# Altium schematic sheet [11]-BATTERY_BACKUP.SchDoc
size A4
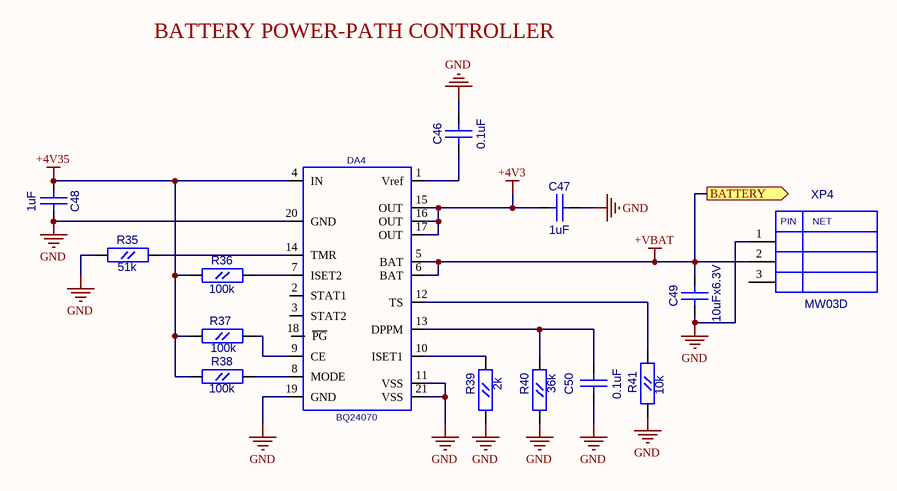
[diagram p0: [11]-BATTERY_BACKUP.SchDoc]

## Parts
C46  0.1uF  [CC0603]
C47  1uF  [CC0603]
C48  1uF  [CC0603]
C49  10uFx6.3V  [CC0805]
C50  0.1uF  [CC0603]
DA4  BQ24070  [P-PQFP-N20]
R35  51k  [RC0603]
R36  100k  [RC0603]
R37  100k  [RC0603]
R38  100k  [RC0603]
R39  2k  [RC0603]
R40  36k  [RC0603]
R41  10k  [RC0603]
XP4  MW03D  [MW03D]

## Ports
BATTERY (out)

## Nets
+4V3: C47.1(A) DA4.15(OUT) DA4.16(OUT) DA4.17(OUT)
+4V35: C48.1(A) DA4.4(IN) R36.2(B) R37.2(B) R38.2(B)
+VBAT: C49.2(B) DA4.5(BAT) DA4.6(BAT) XP4.2 ; port BATTERY
GND: C46.2(B) C47.2(B) C48.2(B) C49.1(A) C50.2(B) DA4.11(VSS) DA4.19(GND) DA4.20(GND) DA4.21(VSS) R35.2(B) R39.2(B) R40.2(B) R41.2(B) XP4.1
NetC46_1: C46.1(A) DA4.1(Vref)
NetC50_1: C50.1(A) DA4.13(DPPM) R40.1(A)
NetDA4_7: DA4.7(ISET2) R36.1(A)
NetDA4_8: DA4.8(MODE) R38.1(A)
NetDA4_9: DA4.9(CE) R37.1(A)
NetDA4_10: DA4.10(ISET1) R39.1(A)
NetDA4_12: DA4.12(TS) R41.1(A)
NetDA4_14: DA4.14(TMR) R35.1(A)

Not connected (* = marked no-connect by the designer): DA4 2(STAT1) 3(STAT2) 18(~{PG}); XP4 3

## Notes on the sheet
- BATTERY POWER-PATH CONTROLLER
- (in symbol MW03D) PIN; NET

## Library data of the parts
C46-C48 C50 = CC0603
  C46 C50: Value: 0.1uF
  C47 C48: Value: 1uF
C49 = CC0805: Value: 10uFx6.3V
R35-R41 = RC0603
  R35: Value: 51k
  R36-R38: Value: 100k
  R39: Value: 2k
  R40: Value: 36k
  R41: Value: 10k
DA4 = BQ24070: Value: *
XP4 = MW03D: Value: *